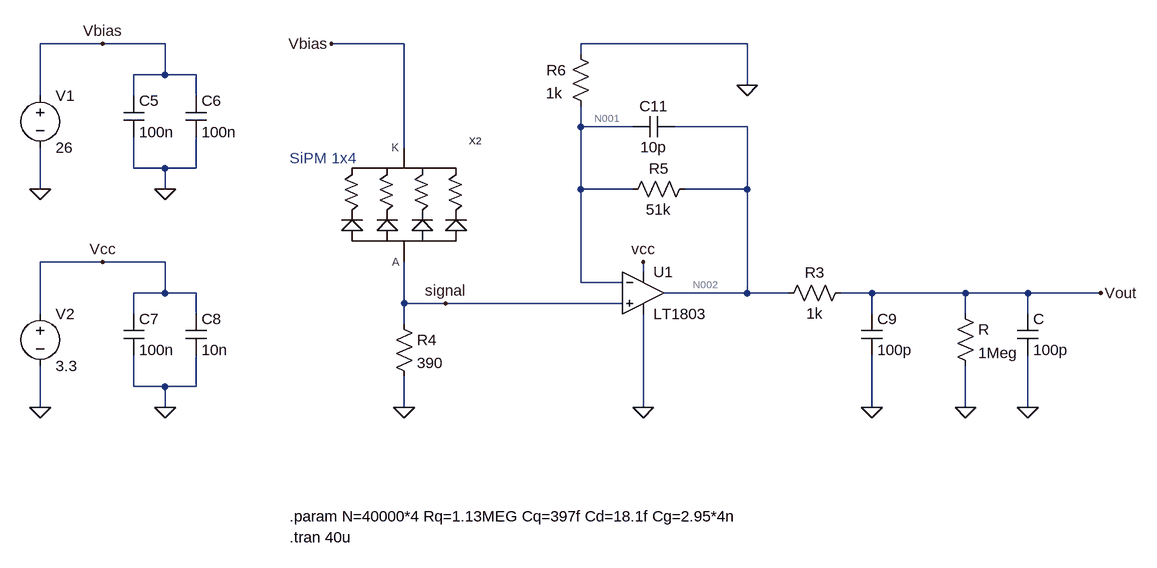
[diagram p0: schematic voltagemode_update_current_SiPM.asc]
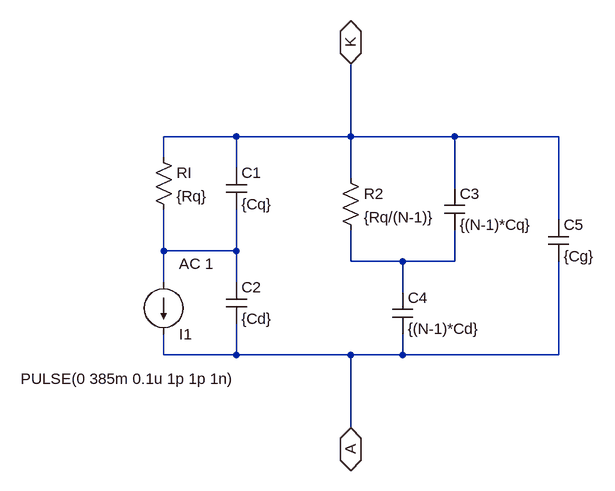
[diagram p1: sub-circuit sipm_equivalente_controllo_tensione_pulse.asc]
* voltagemode_update_current_SiPM.asc
V1 Vbias 0 26
C5 Vbias 0 100n
R4 signal 0 390
R6 0 N001 1k
R5 N002 N001 51k
X§X2 Vbias signal sipm_equivalente_controllo_tensione_pulse
C6 Vbias 0 100n
V2 vcc 0 3.3
C7 vcc 0 100n
C8 vcc 0 10n
C11 N002 N001 10p
R3 Vout N002 1k
C9 Vout 0 100p
C Vout 0 100p
R Vout 0 1Meg
* U1: LT1803 (symbol OpAmps\LT1803 not available, pins judged from their places): In+=signal In-=N001 V+=vcc V-=0 OUT=N002

* block symbol definitions
.subckt sipm_equivalente_controllo_tensione_pulse K A
RI K N001 {Rq}
R2 K N002 {Rq/(N-1)}
C1 K N001 {Cq}
C2 N001 A {Cd}
C3 K N002 {(N-1)*Cq}
C4 N002 A {(N-1)*Cd}
C5 K A {Cg}
I1 N001 A PULSE(0 385m 0.1u 1p 1p 1n) AC 1
.ends sipm_equivalente_controllo_tensione_pulse

.param N=40000*4 Rq=1.13MEG Cq=397f Cd=18.1f Cg=2.95*4n
.tran 40u
* SiPM 1x4
.backanno
.end

* Results of the author's LTspice run, read from the files saved beside the schematic
* Operating Point, zero values left out:
*   V(n001) = 143.5 µV
*   V(n002) = 126.1 mV
*   V(signal) = -945.9 µV
*   V(vbias) = 26 V
*   V(vcc) = 3.3 V
*   V(vout) = 125.9 mV
*   I(R) = 125.9 nA
*   I(R3) = -125.9 nA
*   I(R4) = -2.425 µA
*   I(R5) = 2.469 µA
*   I(R6) = -143.5 nA
*   I(V2) = -2.9 mA
*   Ix(u1:1) = 2.425 µA
*   Ix(u1:2) = 2.325 µA
*   Ix(u1:3) = 2.9 mA
*   Ix(u1:4) = -2.9 mA
*   Ix(u1:5) = -2.595 µA
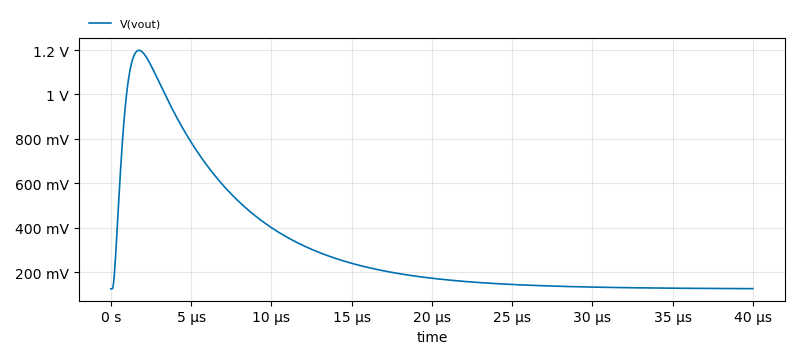
[diagram p2: Transient Analysis of voltagemode_update_current_SiPM.asc, plotted from the saved traces]
* Transient Analysis, 1 run:
*   V(vout): min 125.9 mV, max 1.199 V, average 320.1 mV, rms 430.7 mV, last 126.6 mV